# Altium schematic sheet razbotLowVoltageProt.SchDoc
size A
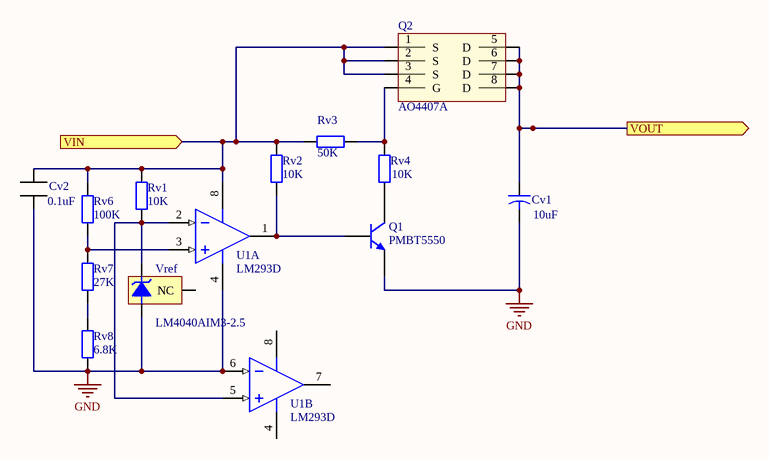
[diagram p0: razbotLowVoltageProt.SchDoc]

## Parts
Cv1  value 10uF  [CAPR5-4X5]  (hidden comment: 10uF EL)
Cv2  value 0.1uF  [C0805]  (hidden comment: 0.1uF 0603)
Q1  PMBT5550  [SOT23_M]
Q2  AO4407A  [SOIC8_M]
Rv1  value 10K  [J1-0603]  (hidden comment: 10K 0603)
Rv2  value 10K  [J1-0603]  (hidden comment: 10K 0603)
Rv3  value 50K  [J1-0603]  (hidden comment: 50K 0603)
Rv4  value 10K  [J1-0603]  (hidden comment: 10K 0603)
Rv6  value 100K  [J1-0603]  (hidden comment: 100K 0603)
Rv7  value 27K  [J1-0603]  (hidden comment: 27K 0603)
Rv8  value 6.8K  [J1-0603]  (hidden comment: 6.8K 0603)
U1  LM293D  [SO8_M]  (parts A,B of 2)
Vref  LM4040AIM3-2.5  [MF03A_N]

## Ports
VIN (in), VOUT (out)

## Nets
GND: Cv1.2 Cv2.1(P1) Q1.2(E) Rv8.2 U1.4(V-) U1.6(IN-) Vref.2(-V)
VIN: Cv2.2(P2) Q2.1(S) Q2.2(S) Q2.3(S) Rv1.1 Rv2.1 Rv3.2 Rv6.1 U1.8(V+) ; port VIN
VOUT: Cv1.1 Q2.5(D) Q2.6(D) Q2.7(D) Q2.8(D) ; port VOUT
NetQ1_1: Q1.1(B) Rv2.2 U1.1(OUT)
NetQ1_3: Q1.3(C) Rv4.1
NetQ2_4: Q2.4(G) Rv3.1 Rv4.2
NetRv1_2: Rv1.2 U1.2(IN-) U1.5(IN+) Vref.1(+V)
NetRv6_2: Rv6.2 Rv7.1 U1.3(IN+)
NetRv7_2: Rv7.2 Rv8.1

Not connected (* = marked no-connect by the designer): U1 7(OUT); Vref 3(NC)

## Library data of the parts
Cv1 = Cap2: Capacitor; Published: 23-Sep-2002; PackageReference: CAPR5-4X5; Publisher: Altium Limited
Cv2 = CAP: Capacitor
Q1 = PMBT5550: NPN High-voltage Transistor; Published: 17-Sep-2003; LatestRevisionDate: 12-Dec-2006; LatestRevisionNote: IPC-7351 Footprint Added.; DatasheetVersion: 15-Apr-1999; PackageVersion: May-1999; PackageReference: SOT23; Publisher: Altium Limited; PackageDescription: 3-Pin SOT-23 Package 0.95 mm Pitch, 2.3 mm Lead Span; ComponentLink1Description: Manufacturer Link; ComponentLink1URL: http://www.semiconductors.philips.com/; ComponentLink2Description: Datasheet; ComponentLink2URL: http://www.semiconductors.philips.com/acrobat/datasheets/PMBT5550_4.pdf
Q2 = AO4407A: P ch MOSFET 12A
Rv1-Rv4 Rv6-Rv8 = Res2: Resistor; Published: 8-Jun-2000; LatestRevisionDate: 17-Jul-2002; LatestRevisionNote: Re-released for DXP Platform.; PackageReference: AXIAL-0.4; Publisher: Altium Limited
U1 = LM293D: Low-Power Dual Voltage Comparator; Published: 24-Aug-2001; LatestRevisionDate: 13-Apr-2006; LatestRevisionNote: IPC-7351 Footprint Added.; DatasheetVersion: Jun-1998; PackageVersion: Dec-2002; PackageReference: SO8; Publisher: Altium Limited; PackageDescription: 8-Pin Small Outline Integrated Circuit 1.27 mm Pitch; Code_JEDEC: MS-012-AA; Code_IPC: SOIC127P600-8; ComponentLink1Description: Manufacturer Link; ComponentLink1URL: http://www.st.com/; ComponentLink2Description: Datasheet; ComponentLink2URL: http://www.st.com/stonline/products/literature/ds/2164/lm293.pdf
Vref = LM4040AIM3-2.5: Precision Micropower Shunt Voltage Reference; Manufacturer: National Semiconductor; CompType: Voltage Reference IC; PackageTopMarking: R2A*XTT; Published: 4-Dec-2008; DatasheetVersion: Apr-2005; PackageVersion: revB, Mar-2003; PackageReference: MF03A; Publisher: Altium Limited; PackageDescription: Molded SOT-23, .115 x .051 x .037in Body, 3 Lead, .075 in Pitch; PartNumber: LM4040AIM3-2.5; RoHS: O; PinCount: 3; DigiKeyPartNumber: LM4040AIM3-2.5CT-ND; ComponentLink1Description: LM4040 Datasheet; ComponentLink1URL: http://www.national.com/ds/LM/LM4040.pdf; ComponentLink2Description: LM4040 Web Page; ComponentLink2URL: http://www.national.com/pf/LM/LM4040.html; ComponentLink3Description: MF03A Package Page; ComponentLink3URL: http://www.national.com/packaging/folders/mf03a.html